# EAGLE design RunningAnalyzer_v1 (EAGLE 8.6.0)
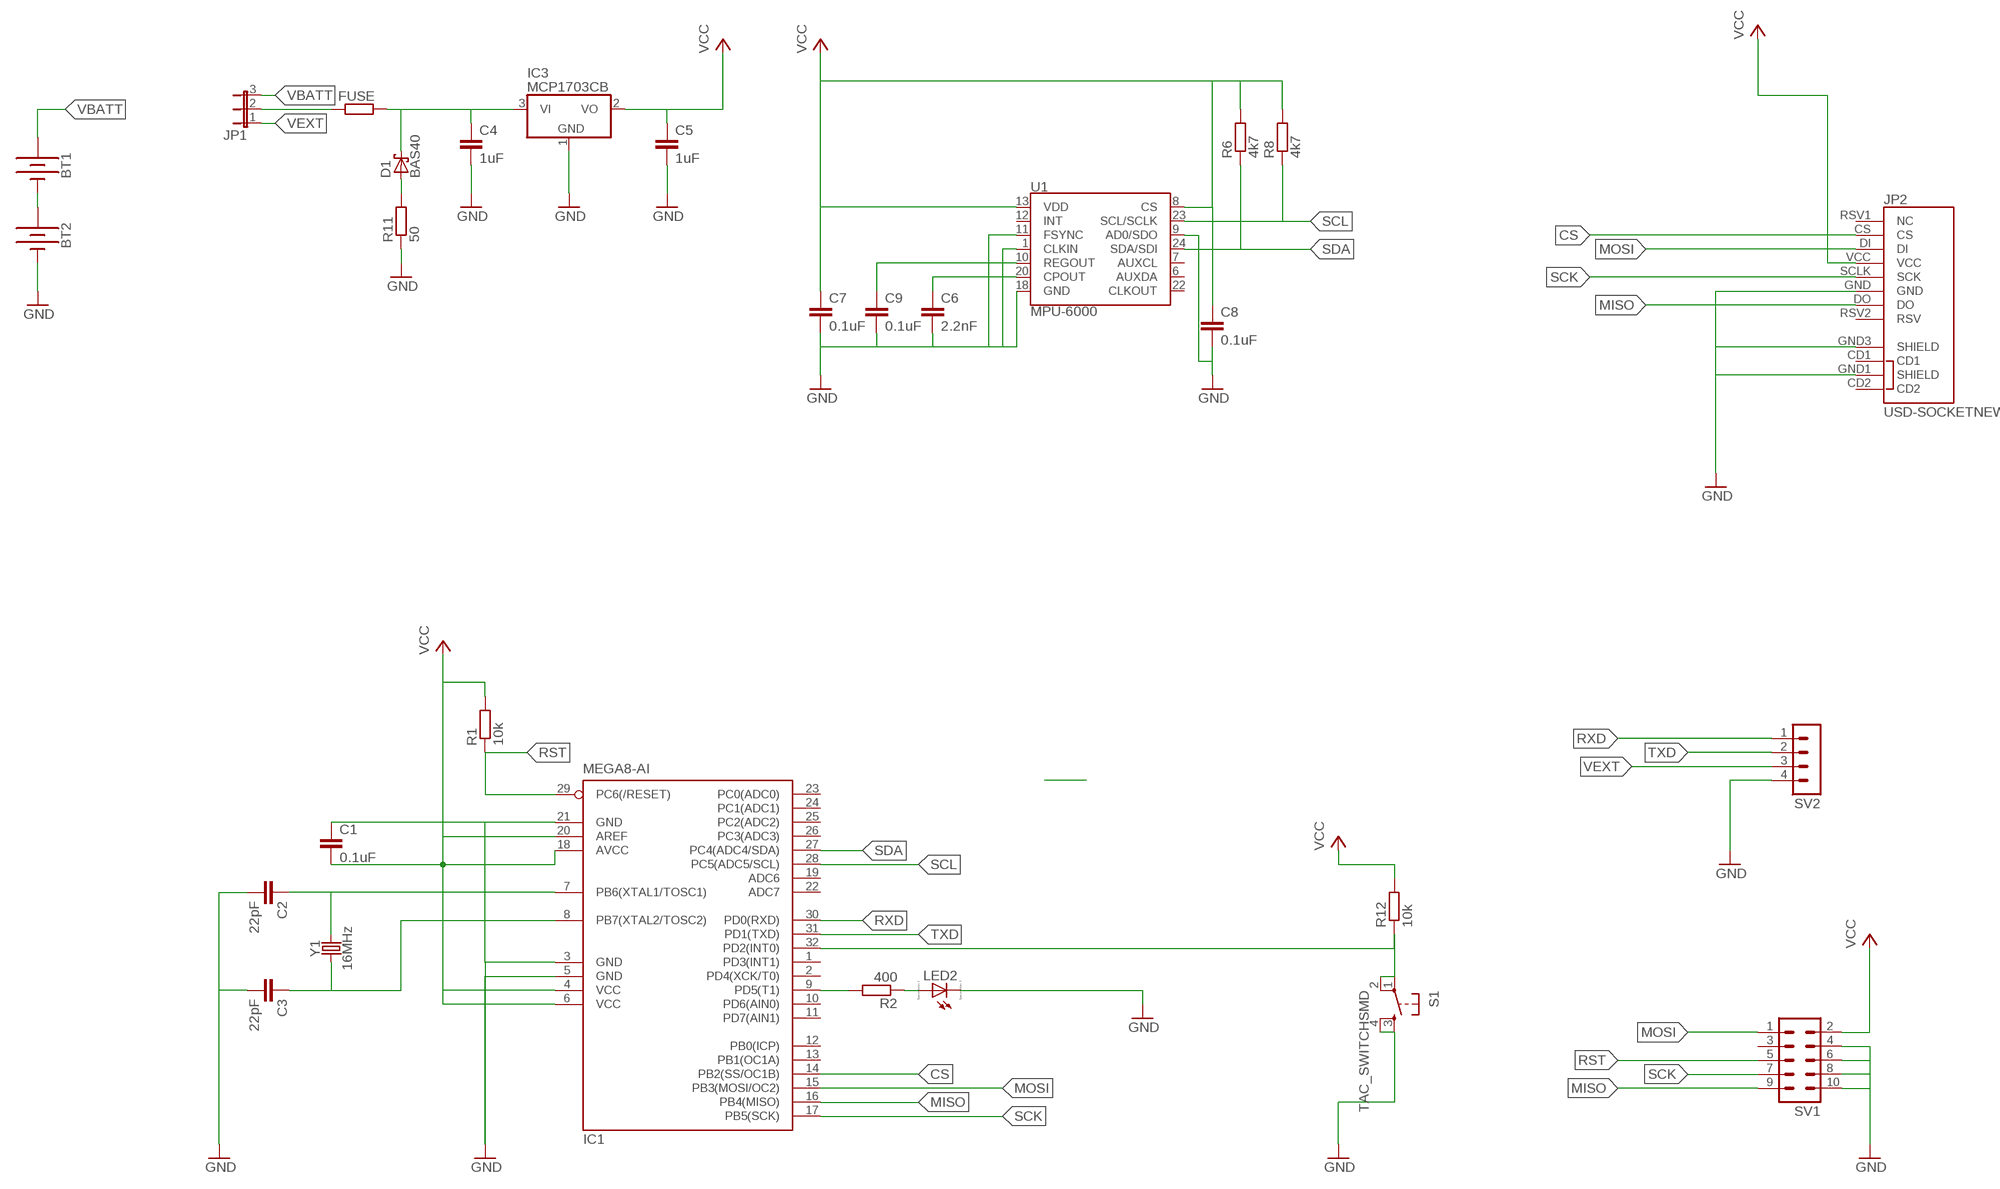
[diagram p0: schematic, sheet 1]

## Parts
BT1  BATTERY-20MM_SMD_4LEGS_OVERPASTE  [BATTCON_20MM_4LEGS_OVERPASTE]
BT2  BATTERY-20MM_SMD_4LEGS_OVERPASTE  [BATTCON_20MM_4LEGS_OVERPASTE]
C1  0.1uF  C-EUC0805  [C0805]
C2  22pF  C-EUC0805  [C0805]
C3  22pF  C-EUC0805  [C0805]
C4  1uF  C-EUC0805  [C0805]
C5  1uF  C-EUC0805  [C0805]
C6  2.2nF  C-EUC0805  [C0805]
C7  0.1uF  C-EUC0805  [C0805]
C8  0.1uF  C-EUC0805  [C0805]
C9  0.1uF  C-EUC0805  [C0805]
D1  BAS40  [SOT23]
FUSE  R-EU_M1206  [M1206]
IC1  MEGA8-AI  [TQFP32-08]
IC3  MCP1703CB  [SOT23]
JP1  JP2E  [JP2]
JP2  USD-SOCKETNEW  [MICRO-SD-SOCKET-PP]
LED2  LED_E  [LED_1206]
R1  10k  R-EU_R1206  [R1206]
R2  400  R-EU_R0805  [R0805]
R6  4k7  R-EU_R0805  [R0805]
R8  4k7  R-EU_R0805  [R0805]
R11  50  R-EU_R0805  [R0805]
R12  10k  R-EU_R1206  [R1206]
S1  TAC_SWITCHSMD  [TACTILE-SWITCH-SMD]
SV1  MA05-2  [MA05-2]
SV2  MA04-1  [MA04-1]
U1  MPU-6000  [QFN-24-EP]
Y1  16MHz  CRYSTALSMD-HC49UP  [HC49UP]

## Nets
CS: IC1.14(PB2(SS/OC1B)) JP2.CS
GND: BT2.2(-) C1.1 C2.2 C3.2 C4.2 C5.2 C6.2 C7.2 C8.2 C9.2 IC1.3(GND) IC1.5(GND) IC1.21(GND) IC3.1(GND) JP2.GND JP2.GND1(SHIELD) JP2.GND3(SHIELD) LED2.C R11.1 S1.3 S1.4 SV1.4 SV1.6 SV1.8 SV1.10 SV2.4 U1.1(CLKIN) U1.9(AD0/SDO) U1.11(FSYNC) U1.18(GND)
MISO: IC1.16(PB4(MISO)) JP2.DO SV1.9
MOSI: IC1.15(PB3(MOSI/OC2)) JP2.DI SV1.1
N$2: IC1.9(PD5(T1)) R2.2
N$3: C6.1 U1.20(CPOUT)
N$5: C9.1 U1.10(REGOUT)
N$6: D1.1(A) R11.2
N$7: C3.1 IC1.8(PB7(XTAL2/TOSC2)) Y1.1
N$8: C2.1 IC1.7(PB6(XTAL1/TOSC1)) Y1.2
N$9: IC1.32(PD2(INT0)) R12.1 S1.1 S1.2
N$13: LED2.A R2.1
N$14: FUSE.1 JP1.2
N$15: BT1.2(-) BT2.1(+)
N$16: C4.1 D1.3(C) FUSE.2 IC3.3(VI)
RST: IC1.29(PC6(/RESET)) R1.1 SV1.5
RXD: IC1.30(PD0(RXD)) SV2.1
SCK: IC1.17(PB5(SCK)) JP2.SCLK(SCK) SV1.7
SCL: IC1.28(PC5(ADC5/SCL)) R8.1 U1.23(SCL/SCLK)
SDA: IC1.27(PC4(ADC4/SDA)) R6.1 U1.24(SDA/SDI)
TXD: IC1.31(PD1(TXD)) SV2.2
VBATT: BT1.1(+) JP1.3
VCC: C1.2 C5.1 C7.1 C8.1 IC1.4(VCC) IC1.6(VCC) IC1.18(AVCC) IC1.20(AREF) IC3.2(VO) JP2.VCC R1.2 R6.2 R8.2 R12.2 SV1.2 U1.8(CS) U1.13(VDD)
VEXT: JP1.1 SV2.3
Unconnected: IC1.1(PD3(INT1)) IC1.2(PD4(XCK/T0)) IC1.10(PD6(AIN0)) IC1.11(PD7(AIN1)) IC1.12(PB0(ICP)) IC1.13(PB1(OC1A)) IC1.19(ADC6) IC1.22(ADC7) IC1.23(PC0(ADC0)) IC1.24(PC1(ADC1)) IC1.25(PC2(ADC2)) IC1.26(PC3(ADC3)) JP2.CD1 JP2.CD2 JP2.RSV1(NC) JP2.RSV2(RSV) SV1.3 U1.6(AUXDA) U1.7(AUXCL) U1.12(INT) U1.22(CLKOUT)

## Library data of the parts
BT1 BT2 = SparkFun-Batteries:BATTERY: Battery - Single Cell A variety of battery chemistries, sizes, and footprints. Device List: 20MM_PTH - Coin Cell Battery Holder - 20mm (PTH) <https://www.sparkfun.com/products/783> 6.8MM_PTH - Coin Cell Battery Holder - 6.8MM(SMD) <https://www.digikey.com/product-detail/en/seiko-instruments/MS621FE-FL11E/728-1057-ND/1889208?WT.srch=1&gclid=CNOQ5a6LzdQCFZS2wAodXCkE0g> 12MM_SMD - Coin Cell Battery Holder - 12mm (SMD) <https://www.sparkfun.com/products/10592> 12MM_PTH - Coin Cell Battery Holder - 12mm (PTH) <https://www.sparkfun.com/products/7948> 20MM_SMD - 20mm Coin Cell Battery Holder (SMD) (2 legs) Used on the Big Time Watch Kit <https://www.sparkfun.com/products/11734> 20MM_SMD_4LEGS - Coin Cell Battery Holder - 20mm (SMD) <https://www.sparkfun.com/products/11892> 20MM_SMD_4LEGS_OVERPASTE - Coin Cell Battery Holder - 20mm (SMD) <https://www.sparkfun.com/products/11892> (Over-paste on the legs) 24.5MM_PTH - Coin Cell Battery Holder - 24.5mm (PTH) <https://www.sparkfun.com/products/8863> 9V - 9V Battery Holder - PC Mount Used on the SparkFun SparkPunk Sound Kit <https://www.sparkfun.com/products/11177> and SparkFun SparkPunk Sequencer Kit <https://www.sparkfun.com/products/12707> 18650 - Battery Holder - 18650 (PTH) <https://www.sparkfun.com/products/13113> AA - Battery Holder - 1xAA (PTH) <https://www.sparkfun.com/products/7949> AAA - Battery Holder - 1xAAA (PTH) <https://www.sparkfun.com/products/12718> AA_KIT - Battery Holder - 1xAA (PTH) <https://www.sparkfun.com/products/7949> Special kit package - pads only have exposed copper on one side of the board. AAA_KIT - Battery Holder - 1xAAA (PTH) <https://www.sparkfun.com/products/12718> Special kit package - pads only have exposed copper on one side of the board.; PROD_ID: PRT-11892; SF_SKU: BATT-10373
C1-C9 = rcl:C-EU: CAPACITOR, European symbol; SPICEPREFIX: C
D1 = diode:BAS40: Silicon Schottky Diodes General-purpose diode for high-speed switching
FUSE R2 R6 R8 R11 = rcl:R-EU_: RESISTOR, European symbol; SPICEPREFIX: R
IC1 = atmel:MEGA8: MICROCONTROLLER 8 Kbytes FLASH, 1 kbytes SRAM, 512 bytes EEPROM, USART, 6-channel 10 bit ADC, 2-channel 8 bit ADC Pin compatible with Atmega48, ATMega88, ATMega168 Source: avr.lbr; MPN: ATMEGA8-16AU; OC_FARNELL: 9171371; OC_NEWARK: 73M8863
IC3 = linear:MCP1703: 250 mA, 16V, Low Quiescent Current LDO Regulator Source: http://ww1.microchip.com/downloads/en/DeviceDoc/22049b.pdf
JP1 = jumper:JP2E: JUMPER
JP2 = SparkFun-Retired:USD-SOCKET: microSD Socket Push-push type uSD socket. Schematic element and footprint production proven. Spark Fun Electronics SKU : PRT-00127. tDoc lines correctly indicate media card edge positions when inserting (unlocked, locked, depressed). NOTE: CD1 and CD2 are connected internally; PROD_ID: CONN-07820
LED2 = eagle-ltspice:LED_E: LED Source: http://www.osram.convergy.de Source: www.luxeon.com Source: www.kingbright.com; SPICEMODEL: NONE; SPICEPREFIX: D; SPICETYPE: diode
R1 R12 = resistor:R-EU_: RESISTOR, European symbol
S1 = SparkFun-Retired:TAC_SWITCH: Momentary Switch Button commonly used for reset or general input. Spark Fun Electronics SKU : COM-00097 SMT- SWCH-08247; PROD_ID: SWCH-08247
SV1 = con-lstb:MA05-2: PIN HEADER; OC_FARNELL: unknown; OC_NEWARK: unknown
SV2 = con-lstb:MA04-1: PIN HEADER; OC_FARNELL: unknown; OC_NEWARK: unknown
U1 = SparkFun-Sensors:MPU-6000: Invensense MPU-6000 6-Axis Gryoscope/Accelerometer 3-axis gyroscope, 3-axis accelerometer in a 4x4 package. The MPU-6000 is the world’s first 6-axis I²C MotionTracking device designed for the low power, low cost, and high performance requirements of smartphones, tablets and wearable sensors. Datasheet <http://cdn.sparkfun.com/datasheets/Components/General%20IC/PS-MPU-6000A.pdf> SparkFun Products MPU-6000 - Motion Processing Unit <https://www.sparkfun.com/products/11234> (SEN-11234) SparkFun UDB5 - PIC UAV Development Board <https://www.sparkfun.com/products/11703> (GPS-11703); PROD_ID: IC-11089; SF_ID: SEN-11234
Y1 = SparkFun-Clocks:CRYSTAL: Crystals (Generic) These are passive quartz crystals, which can be used as a clock source for a microcontroller. Crystal's are two-terminal devices. They require external "load" capacitors to generate an oscillating signal.

## Board
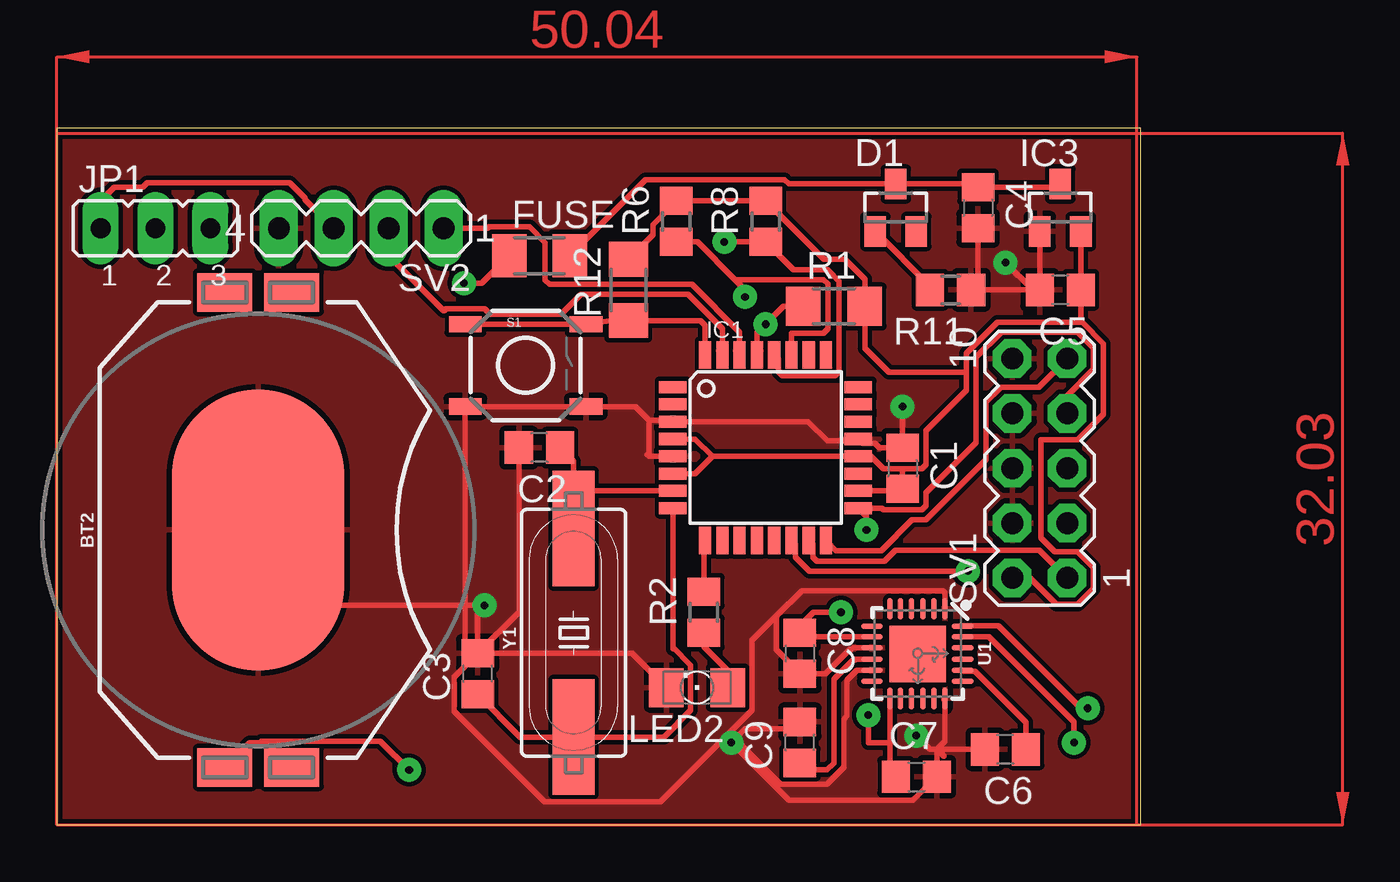
[diagram p1: board, top side]
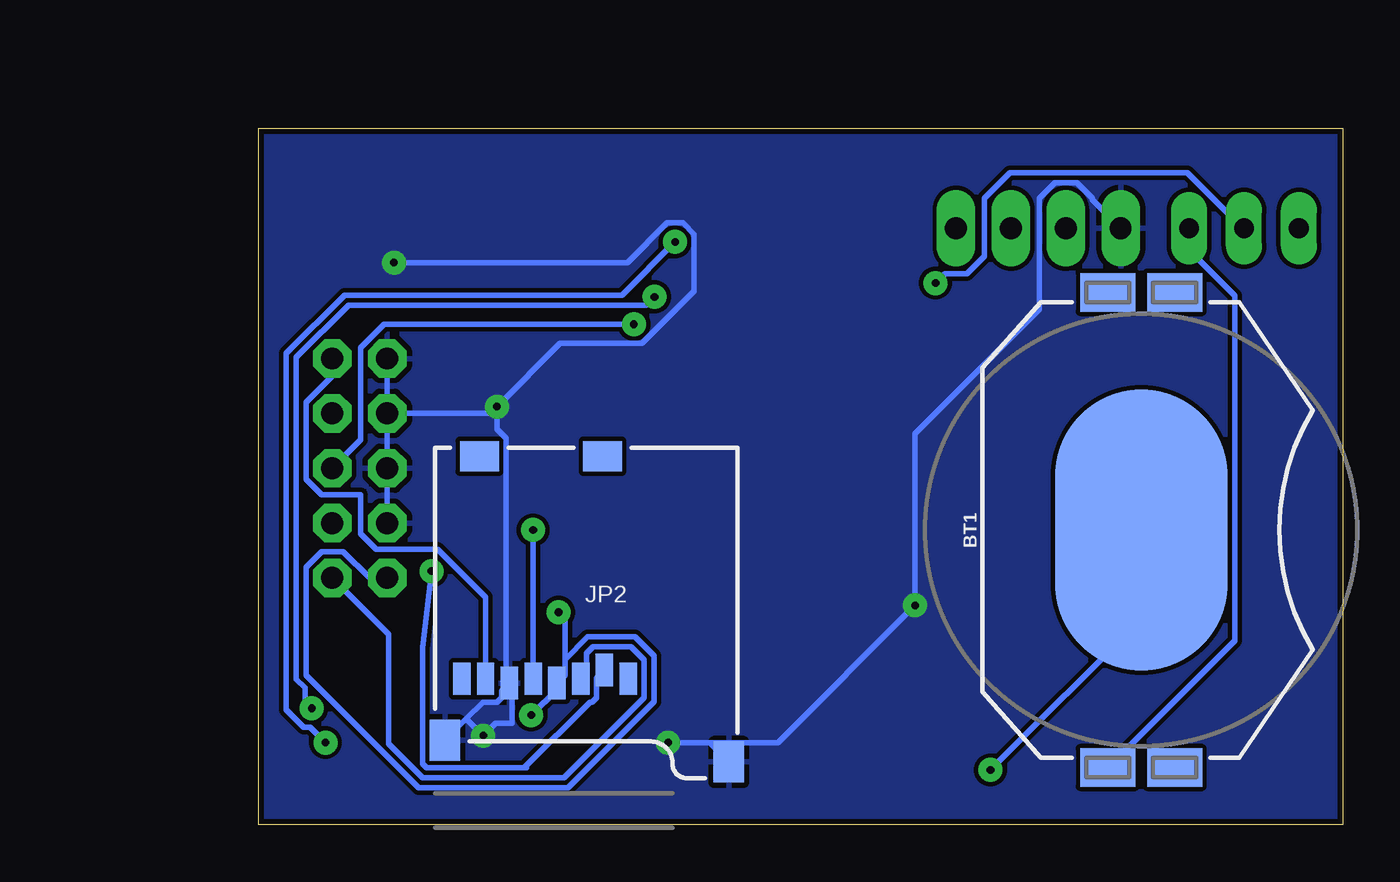
[diagram p2: board, bottom side, seen from below]

Size 50.22 x 32.25 mm. Coordinates in mm from the lower left corner, seen from the top.
Outline: 0,0 50.22,0 50.22,32.25 0,32.25 0,0
Copper layers (1*16): Top 0.035mm / dielectric 1.5mm / Bottom 0.035mm
Design rules "default *": minimum track width 10mil, minimum drill 0.35mm, track to track 8mil, track to pad 8mil, pad to pad 8mil, via to via 8mil, smd to smd 6mil, copper to edge 10mil, drill to drill 6mil, minimum pad ring 15mil, minimum via ring 15mil, stop-mask expansion 4mil, vias tented up to drill 0mil, thermal gap 10mil

### Footprints (pad centres in the part's own frame; a part is rotated, then mirrored left to right if it is on the bottom)
BATTCON_20MM_4LEGS_OVERPASTE = smd 1.778 x 2.54: 1 -11,1.55; 3 11,1.55; P$1 -11,-1.55; P$2 11,-1.55 | smd 13 x 8: 2 0,0
C0805 = smd 1.3 x 1.5: 1 -0.95,0; 2 0.95,0
SOT23 = smd 1 x 1.4: 1 -0.95,-1.1; 2 0.95,-1.1; 3 0,1.1
M1206 = smd 1.6 x 2: 1 -1.4,0; 2 1.4,0
TQFP32-08 = smd 1.27 x 0.559: 1 -4.293,2.8; 2 -4.293,2; 3 -4.293,1.2; 4 -4.293,0.4; 5 -4.293,-0.4; 6 -4.293,-1.2; 7 -4.293,-2; 8 -4.293,-2.8; 17 4.293,-2.8; 18 4.293,-2; 19 4.293,-1.2; 20 4.293,-0.4; 21 4.293,0.4; 22 4.293,1.2; 23 4.293,2; 24 4.293,2.8 | smd 0.559 x 1.27: 9 -2.8,-4.293; 10 -2,-4.293; 11 -1.2,-4.293; 12 -0.4,-4.293; 13 0.4,-4.293; 14 1.2,-4.293; 15 2,-4.293; 16 2.8,-4.293; 25 2.8,4.293; 26 2,4.293; 27 1.2,4.293; 28 0.4,4.293; 29 -0.4,4.293; 30 -1.2,4.293; 31 -2,4.293; 32 -2.8,4.293
JP2 = drill 0.914 long: 1 -2.54,0; 2 0,0; 3 2.54,0
MICRO-SD-SOCKET-PP = smd 1.8 x 1.4: CD1 -2.05,0.4; CD2 -7.75,0.4 | smd 0.8 x 1.5: CS -7.84,10.3; DI -6.74,10.7; DO -2.34,10.7; GND -3.44,10.9; RSV1 -8.94,10.7; RSV2 -1.24,10.7; SCLK -4.54,10.7; VCC -5.64,10.9 | smd 1.4 x 1.9: GND1 -13.6,14.55; GND3 -0.45,13.55
LED_1206 = smd 1.6 x 1.803: A -1.422,0; C 1.422,0
R1206 = smd 1.6 x 1.803: 1 -1.422,0; 2 1.422,0
R0805 = smd 1.3 x 1.5: 1 -0.95,0; 2 0.95,0
TACTILE-SWITCH-SMD = smd 1.524 x 0.762: 1 -2.794,1.905; 2 2.794,1.905; 3 -2.794,-1.905; 4 2.794,-1.905
MA05-2 = drill 1.016 octagon: 1 -5.08,-1.27; 2 -5.08,1.27; 3 -2.54,-1.27; 4 -2.54,1.27; 5 0,-1.27; 6 0,1.27; 7 2.54,-1.27; 8 2.54,1.27; 9 5.08,-1.27; 10 5.08,1.27
MA04-1 = drill 1.016 long: 1 -3.81,0; 2 -1.27,0; 3 1.27,0; 4 3.81,0
QFN-24-EP = smd 1.016 x 0.254: 1 -2.066,1.257; 2 -2.066,0.75; 3 -2.066,0.247; 4 -2.066,-0.287; 5 -2.066,-0.792; 6 -2.066,-1.297; 13 2.086,-1.297; 14 2.086,-0.792; 15 2.086,-0.287; 16 2.086,0.247; 17 2.086,0.75; 18 2.086,1.257 | smd 0.254 x 1.016: 7 -1.267,-2.122; 8 -0.762,-2.122; 9 -0.258,-2.122; 10 0.278,-2.122; 11 0.78,-2.122; 12 1.287,-2.122; 19 1.287,2.082; 20 0.78,2.082; 21 0.278,2.082; 22 -0.258,2.082; 23 -0.762,2.082; 24 -1.267,2.082 | smd 2.616 x 2.616: P$1 0.02,-0.01
HC49UP = smd 5.334 x 1.93: 1 -4.826,0; 2 4.826,0

### Placement (x,y rotation side)
BT1  9.33,13.65 90 bottom
BT2  9.33,13.65 90 top
C1  39.18,16.51 270 top
C2  22.35,17.46 180 top
C3  19.49,6.99 90 top
C4  42.67,28.57 270 top
C5  46.48,24.77 180 top
C6  43.94,3.49 180 top
C7  39.81,2.22 0 top
C8  34.42,7.94 270 top
C9  34.42,3.81 90 top
D1  38.86,28.57 0 top
FUSE  22.35,26.35 0 top
IC1  32.83,17.46 0 top
IC3  46.48,28.57 0 top
JP1  4.57,27.62 0 top
JP2  42.04,17.46 180 bottom
LED2  29.65,6.35 180 top
R1  36,24 0 top
R2  29.97,9.84 90 top
R6  28.7,27.94 90 top
R8  32.83,27.94 90 top
R11  41.4,24.77 180 top
R12  26.48,24.77 90 top
S1  21.72,21.27 0 top
SV1  45.53,16.51 90 top
SV2  14.1,27.62 180 top
U1  39.88,7.94 270 top
Y1  23.94,8.89 90 top

### Tracks (layer width: path | path; a pad name or v marks a point on that pad's centre or on a via)
CS  (via drill 0.35)
  Top 0.254: IC1.14 34.22,12.98 34.22,12.4 34.87,11.75 v42.2,11.75
  Bottom 0.254: JP2.CS 34.57,6.79 34.57,5.88 34.76,5.68 34.86,5.68 37.91,2.63 | v42.2,11.75 42.62,8.2 42.62,2.83 42.42,2.63 37.91,2.63 | 37.81,2.63 37.91,2.63
GND  (via drill 0.35)
  Top 0.254: IC1.5 27.43,17.06 | 27.43,17.06 27.43,18.73 | 27.43,18.73 28.47,18.73 IC1.3 34.8,18.66 35.69,17.78 37.04,17.78 IC1.21 37.31,17.67 37.89,17.67 38.11,17.46 C1.1 v39.18,19.37 | 41.08,5.8 U1.18 41.13,3.86 40.77,3.49 | 41.08,3.17 40.77,3.49 | 40.77,3.49 40.92,3.33 41.08,3.49 C6.2 | 40.77,3.49 C7.2 40.73,2.22 39.65,1.14 33.91,1.14 v31.24,3.81 | U1.9 36.9,8.2 36.82,8.12 36.74,8.12 35.61,6.99 C8.2 | C8.2 | 40.77,3.49 | C5.2 R11.1 42.67,25.09 C4.2 | IC3.1 C5.2 | 27.35,17.14 27.43,17.06 | 27.43,18.73 26.8,19.37 S1.4 S1.3 18.92,7.33 18.41,6.82 18.41,5.25 22.6,1.07 27.96,1.07 32.21,5.31 32.21,8.54 33.34,9.67 | C3.2 21.4,9.84 C2.2 | v31.24,3.81 31.88,4.44 34.1,4.44 C9.2 | C3.2 26.65,7.93 LED2.C | C3.2 19.49,9.84 v19.81,10.16 12.83,10.16 BT2.2 | C5.2 45.21,24.77 v43.94,26.04 | U1.1 41.13,10.74 41.04,10.84 34.5,10.84 33.34,9.67 | 33.34,9.67 33.34,8.1 34.42,7.02 C8.2 | U1.11 37.07,7.16 36.61,6.7 36.61,5.05 36.45,4.89 36.45,2.67 35.66,1.88 33.53,1.88 31.6,3.81 v31.24,3.81 | v39.81,4.13 40.45,3.49 40.77,3.49
  Bottom 0.254: SV1.10 SV1.8 | SV1.8 SV1.6 SV1.4 | v39.18,19.37 39.5,19.05 SV1.8 | v39.18,19.37 39.18,18.32 38.76,17.9 38.76,6.72 JP2.GND | 40.59,4.91 39.82,5.68 39.16,5.68 38.97,5.88 38.97,6.19 JP2.GND | 40.59,4.91 JP2.GND3 | JP2.GND1 29.33,3.81 v31.24,3.81 26.16,3.81 v19.81,10.16 19.81,18.1 14.05,23.86 14.05,29.02 13.33,29.73 12.32,29.73 11.61,29.02 11.61,28.94 SV2.4 | v43.94,26.04 33.13,26.04 31.29,27.87 30.56,27.87 30.04,27.36 30.04,24.71 32.46,22.29 36.26,22.29 v39.18,19.37 | JP2.GND 38.48,6.44 38.48,4.71 39.23,4.71 v39.81,4.13 40.59,4.91
  pour Top: 0,0 0,32 50.04,32 50.04,0
  pour Bottom: 0,0 0,32 50.04,32 50.04,0
MISO
  Top 0.254: SV1.9 45.48,20.27 43.75,20.27 43.04,19.55 43.04,16.91 40.26,14.12 39.61,14.12 38.19,12.7 36.1,12.7 IC1.16
  Bottom 0.254: SV1.9 46.8,20.77 48.02,19.55 48.02,16 47.3,15.29 45.48,15.29 45.48,13.46 44.77,12.75 41.91,12.75 39.7,10.54 JP2.DO
MOSI
  Top 0.254: IC1.15 35.02,12.98 35.02,12.4 35.21,12.21 38.34,12.21 38.85,12.71 45.52,12.71 SV1.1
  Bottom 0.254: SV1.1 44.19,8.82 44.19,3.75 42.61,2.17 36.07,2.17 32.37,5.88 32.37,7.65 32.96,8.24 34.73,8.24 35.02,7.95 35.02,7.04 JP2.DI
N$2
  Top 0.254: IC1.9 29.97,13.11 R2.2
N$3
  Top 0.254: U1.20 42.01,7.11 42.53,7.11 44.89,4.75 C6.1
N$5
  Top 0.254: U1.10 37,7.66 36.95,7.62 36.88,7.62 35.99,6.73 35.99,2.86 35.68,2.54 34.73,2.54 C9.1
N$6
  Top 0.254: D1.1 40.45,24.93 R11.2
N$7
  Top 0.254: IC1.8 28.54,8.21 | 28.54,8.21 28.54,8.14 | C3.1 21.46,4.06 Y1.1 28.11,4.06 29.36,5.31 29.36,7.39 28.54,8.21
N$8
  Top 0.254: IC1.7 24.1,15.46 Y1.2 23.94,16.82 C2.1
N$9
  Top 0.254: IC1.32 30.03,23.12 29.81,23.34 R12.1 25.63,23.34 S1.2 S1.1
N$13
  Top 0.254: R2.1 29.97,8.26 31.08,7.15 LED2.A
N$14  (via drill 0.35)
  Top 0.254: FUSE.1 19.68,25.08 v18.86,25.08
  Bottom 0.254: v18.86,25.08 18.43,25.51 17.4,25.51 16.59,26.33 16.59,29.02 15.41,30.19 7.19,30.19 4.62,27.62 JP1.2
N$15  (via drill 0.35)
  Top 0.254: v16.32,2.54 14.99,3.87 9.48,3.87 9.42,3.81 8.94,3.81 BT2.1
  Bottom 0.254: BT1.2 9.34,9.53 v16.32,2.54
N$16
  Top 0.254: IC3.3 46.33,29.52 C4.1 42.52,29.68 D1.3 33.91,29.68 33.72,29.87 27.27,29.87 FUSE.2
RST  (via drill 0.35)
  Top 0.254: 32.62,21.95 IC1.29 32.43,22.78 v32.83,23.18 33.66,24 R1.1
  Bottom 0.254: SV1.5 45.48,17.83 45.48,22.09 44.4,23.18 v32.83,23.18
RXD
  Top 0.254: 31.44,21.95 IC1.30 31.63,22.81 29.42,25.02 22.82,25.02 22.62,25.22 22.62,26.95 21.89,27.68 20.02,27.68 19.95,27.62 SV2.1
SCK  (via drill 0.35)
  Top 0.254: SV1.7 46.8,19.87 48.02,21.09 48.02,22.09 47.3,22.81 43.75,22.81 42.58,21.64 42.58,17.69 40.26,15.37 40.26,14.77 40.07,14.58 38.29,14.58 38.21,14.66 IC1.17 37.5,14.28 v37.5,13.65
  Bottom 0.254: JP2.SCLK 37.5,8.67 v37.5,13.65
SCL  (via drill 0.35)
  Top 0.254: IC1.28 33.42,21.57 33.42,20.98 33.61,20.79 36.05,20.79 36.24,20.98 36.24,25.16 35.71,25.69 34.13,25.69 R8.1 v30.93,26.99 v30.92,26.99 | U1.23 43.18,8.7 47.12,4.76 v47.12,3.81
  Bottom 0.254: v30.92,26.99 33.39,24.52 46.24,24.52 48.93,21.83 48.93,5.33 48.12,4.51 47.82,4.51 v47.12,3.81
SDA  (via drill 0.35)
  Top 0.254: 34.03,22.47 IC1.27 34.03,22.77 35.52,22.77 35.71,22.96 35.71,25.04 35.52,25.23 31.42,25.23 | R6.1 29.67,26.99 31.42,25.23 | 31.42,25.23 31.88,24.78 v31.88,24.45 | v47.75,5.4 47.43,5.4 43.62,9.21 U1.24
  Bottom 0.254: v31.88,24.45 32.26,24.06 46.05,24.06 48.48,21.64 48.48,6.75 48.07,6.34 48.07,5.71 v47.75,5.4
TXD
  Top 0.254: 30.64,21.95 IC1.31 30.83,22.97 29.23,24.57 24.29,24.57 23.36,23.64 20.08,23.64 19.82,23.89 18.02,23.89 17.95,23.81 17.91,23.81 15.37,26.35 SV2.2
VBATT
  Bottom 0.254: JP1.3 7.11,26.61 5,24.5 5,8.53 BT1.1
VCC  (via drill 0.35)
  Top 0.254: IC3.2 C5.1 47.43,23.33 47.49,23.27 | 30.37,17.06 IC1.20 37.71,17.06 38.29,16.48 39.24,16.48 | IC1.4 29.57,17.86 30.37,17.06 | IC1.6 29.57,16.26 30.37,17.06 | IC1.18 39.08,15.46 C1.2 39.18,16.42 39.24,16.48 | 39.24,16.48 40.07,16.48 40.26,16.67 40.26,18.25 42.13,20.11 42.13,20.95 | 47.49,23.27 48.48,22.28 48.48,19 47.3,17.83 45.58,17.83 45.58,13.3 46.23,12.65 47.3,12.65 48.02,11.94 48.02,10.93 47.3,10.21 46.29,10.21 45.08,11.43 SV1.2 | 47.49,23.27 43.56,23.27 42.13,21.83 42.13,20.95 | 42.13,20.95 38.54,20.95 37.43,22.07 R1.2 37.43,25.26 36.51,26.18 35.55,26.18 R8.2 R6.2 28.7,28.86 27.62,27.78 27.62,27.33 R12.2 | v37.59,5.08 37.59,3.81 38.58,3.81 | C7.1 38.58,2.51 38.58,3.81 | U1.13 38.58,3.81 | U1.8 34.6,8.7 C8.1 34.42,9.21 35.05,9.84 v36.32,9.84
  Bottom 0.254: 36.03,7.65 34.98,8.7 32.77,8.7 31.91,7.84 31.91,5.69 35.88,1.72 42.8,1.72 48.02,6.93 48.02,11.94 47.3,12.65 46.29,12.65 45.08,11.43 SV1.2 | 36.03,7.65 36.03,6.93 JP2.VCC 36.4,6.25 36.96,5.68 36.99,5.68 v37.59,5.08 | 36.03,7.65 36.03,9.55 v36.32,9.84
VEXT
  Top 0.254: SV2.3 11.51,28.94 11.51,29.02 10.79,29.73 4.19,29.73 3.99,29.53 2.67,29.53 2.03,28.89 JP1.1
(copper drawn outside any net)
  shapes: Top area x2